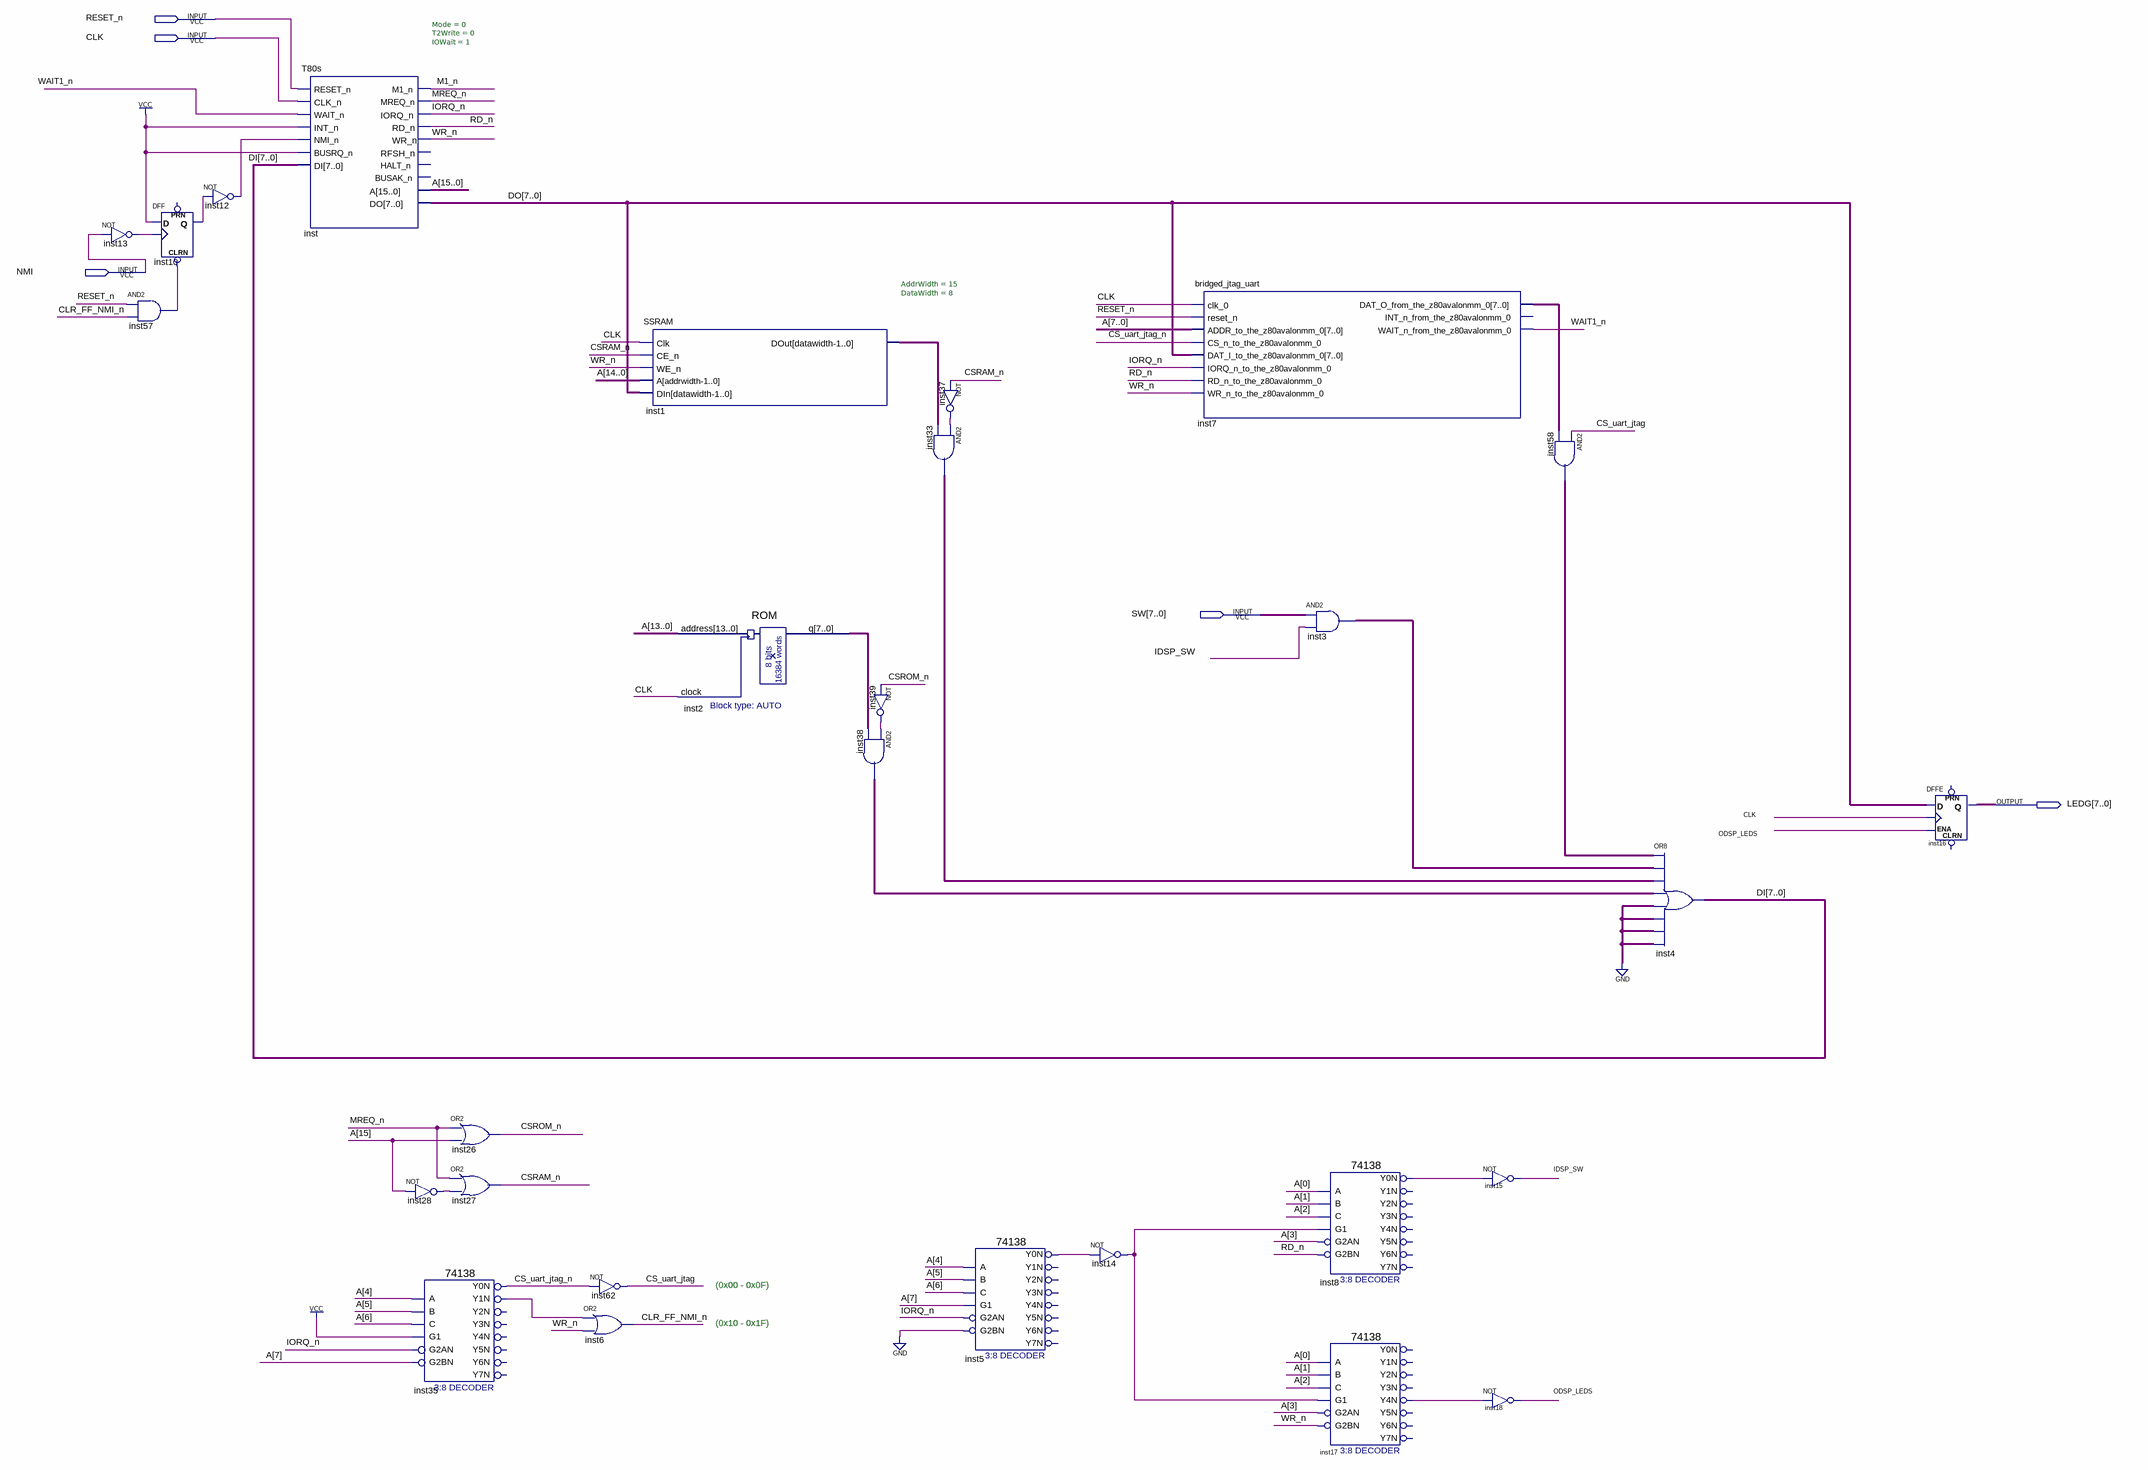
[diagram p0: schematic sheet]
// Quartus schematic sistema.bdf as structural Verilog: 28 symbols, 5 pins
module sistema (
  input  RESET_n,
  input  CLK,
  input  NMI,
  input  [7:0] SW,
  output [7:0] LEDG
);

  wire CLR_FF_NMI_n, CS_uart_jtag, CS_uart_jtag_n, CSRAM_n, CSROM_n, IDSP_SW, inst5_y0n, inst8_y0n, inst10_q,
       inst12_out, inst13_out, inst14_out, inst17_y4n, inst28_out, inst35_y1n, inst37_out, inst39_out,
       inst57_out, IORQ_n, M1_n, MREQ_n, ODSP_LEDS, RD_n, WAIT1_n, WR_n;
  wire [7:0] DI, DO, inst1_dout, inst2_q, inst3_out, inst7_dat_o_from_the_z80avalonmm_0, inst33_out,
       inst38_out, inst58_out;
  wire [15:0] A;

  not inst13 (inst13_out, NMI);
  DFF inst10 (.CLRN(inst57_out), .CLK(inst13_out), .D(1'b1), .Q(inst10_q));  // open: PRN
  and inst57 (inst57_out, RESET_n, CLR_FF_NMI_n);
  not inst12 (inst12_out, inst10_q);
  T80s #(.Mode(0), .T2Write(0), .IOWait(1)) inst (
    .RESET_n(RESET_n), .CLK_n(CLK), .WAIT_n(WAIT1_n), .INT_n(1'b1), .NMI_n(inst12_out), .BUSRQ_n(1'b1),
    .DI(DI), .M1_n(M1_n), .MREQ_n(MREQ_n), .IORQ_n(IORQ_n), .RD_n(RD_n), .WR_n(WR_n), .A(A), .DO(DO));  // open: RFSH_n, HALT_n, BUSAK_n
  not inst28 (inst28_out, A[15]);
  or inst26 (CSROM_n, MREQ_n, A[15]);
  or inst27 (CSRAM_n, MREQ_n, inst28_out);
  \74138  inst35 (
    .A(A[4]), .B(A[5]), .G1(1'b1), .C(A[6]), .G2AN(IORQ_n), .G2BN(A[7]), .Y0N(CS_uart_jtag_n),
    .Y1N(inst35_y1n));  // open: Y2N, Y3N, Y4N, Y5N, Y6N, Y7N
  not inst62 (CS_uart_jtag, CS_uart_jtag_n);
  or inst6 (CLR_FF_NMI_n, inst35_y1n, WR_n);
  SSRAM #(.AddrWidth(15), .DataWidth(8)) inst1 (
    .Clk(CLK), .CE_n(CSRAM_n), .WE_n(WR_n), .A(A[14:0]), .DIn(DO), .DOut(inst1_dout));
  ROM inst2 (.address(A[13:0]), .clock(CLK), .q(inst2_q));
  assign inst38_out = {8{inst39_out}} & inst2_q;  // AND2 inst38, 8 bits wide
  not inst39 (inst39_out, CSROM_n);
  not inst37 (inst37_out, CSRAM_n);
  assign inst33_out = {8{inst37_out}} & inst1_dout;  // AND2 inst33, 8 bits wide
  \74138  inst5 (
    .A(A[4]), .B(A[5]), .G1(A[7]), .C(A[6]), .G2AN(IORQ_n), .G2BN(1'b0), .Y0N(inst5_y0n));  // open: Y1N, Y2N, Y3N, Y4N, Y5N, Y6N, Y7N
  not inst14 (inst14_out, inst5_y0n);
  bridged_jtag_uart inst7 (
    .clk_0(CLK), .reset_n(RESET_n), .ADDR_to_the_z80avalonmm_0(A[7:0]),
    .CS_n_to_the_z80avalonmm_0(CS_uart_jtag_n), .DAT_I_to_the_z80avalonmm_0(DO),
    .IORQ_n_to_the_z80avalonmm_0(IORQ_n), .RD_n_to_the_z80avalonmm_0(RD_n), .WR_n_to_the_z80avalonmm_0(WR_n),
    .DAT_O_from_the_z80avalonmm_0(inst7_dat_o_from_the_z80avalonmm_0), .WAIT_n_from_the_z80avalonmm_0(WAIT1_n));  // open: INT_n_from_the_z80avalonmm_0
  assign inst3_out = SW & {8{IDSP_SW}};  // AND2 inst3, 8 bits wide
  \74138  inst8 (
    .A(A[0]), .B(A[1]), .G1(inst14_out), .C(A[2]), .G2AN(A[3]), .G2BN(RD_n), .Y0N(inst8_y0n));  // open: Y1N, Y2N, Y3N, Y4N, Y5N, Y6N, Y7N
  \74138  inst17 (
    .A(A[0]), .B(A[1]), .G1(inst14_out), .C(A[2]), .G2AN(A[3]), .G2BN(WR_n), .Y4N(inst17_y4n));  // open: Y0N, Y1N, Y2N, Y3N, Y5N, Y6N, Y7N
  not inst15 (IDSP_SW, inst8_y0n);
  not inst18 (ODSP_LEDS, inst17_y4n);
  assign inst58_out = {8{CS_uart_jtag}} & inst7_dat_o_from_the_z80avalonmm_0;  // AND2 inst58, 8 bits wide
  assign DI = inst58_out | inst3_out | inst33_out | inst38_out | {8{1'b0}} | {8{1'b0}} | {8{1'b0}} | {8{1'b0}};  // OR8 inst4, 8 bits wide
  DFFE inst16[7:0] (.D(DO), .CLK(CLK), .ENA(ODSP_LEDS), .Q(LEDG));  // open: PRN, CLRN

  // Notes on the sheet:
  //   (0x00 - 0x0F)
  //   (0x10 - 0x1F)
endmodule
